# Altium project ACTUALFINALECU.PrjPcb (part 2 of 2)

## Sheet Buck.SchDoc
size A4
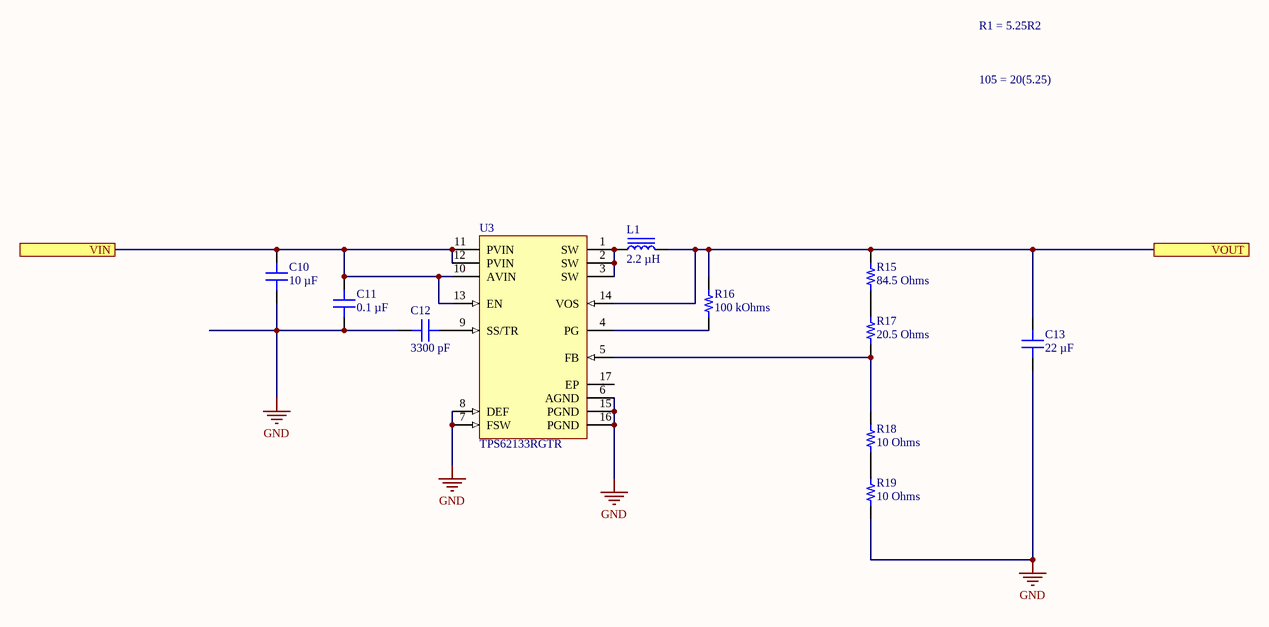
[diagram p7: Buck.SchDoc]

### Parts
C10  10 µF  [CAP 0805_2012]
C11  0.1 µF  [CAP 0805_2012]
C12  3300 pF  [CAP 0805_2012]
C13  22 µF  [CAP 0805_2012]
L1  2.2 µH  [BOURNS SRP5030T]
R15  84.5 Ohms  [RES 0805_2012]
R16  100 kOhms  [RES 0805_2012]
R17  20.5 Ohms  [RES 0805_2012]
R18  10 Ohms  [RES 0805_2012]
R19  10 Ohms  [RES 0805_2012]
U3  TPS62133RGTR  [RGT0016C_V]

### Ports
VIN, VOUT

### Nets
GND: C10.1 C11.1 C12.1 C13.1 R19.1 U3.6(AGND) U3.7(FSW) U3.8(DEF) U3.15(PGND) U3.16(PGND)
VCC5V: C13.2 L1.2 R15.2 R16.2 U3.14(VOS) ; port VOUT
VCC12V: C10.2 C11.2 U3.10(AVIN) U3.11(PVIN) U3.12(PVIN) U3.13(EN) ; port VIN
NetC12_2: C12.2 U3.9(SS/TR)
NetL1_1: L1.1 U3.1(SW) U3.2(SW) U3.3(SW)
NetR15_1: R15.1 R17.2
NetR16_1: R16.1 U3.4(PG)
NetR17_1: R17.1 R18.2 U3.5(FB)
NetR18_1: R18.1 R19.2

Not connected (* = marked no-connect by the designer): U3 17(EP)

### Notes on the sheet
- R1 = 5.25R2
- 105 = 20(5.25)

### Library data of the parts
C10 = CL21Y106KPQVPNE: CAP CER 10UF 10V X7S 0805; manufacturer: Samsung Electro-Mechanics; Tolerance: ±10%; Part Number: CL21Y106KPQVPNE; Value: 10 µF; Applications: Automotive; Capacitance: 10 µF; componentlink1description: Datasheet; componentlink1url: http://www.samsungsem.com/kr/support/product-search/mlcc/CL21Y106KPQVPNE.jsp; componentlink2description: DigiKey Link; componentlink2url: https://www.digikey.com/en/products/detail/samsung-electro-mechanics/CL21Y106KPQVPNE/5961169; Device Package: 0805 (2012 Metric); lastupdated: 2023-10-22 7:13:43 PM; Lifecycle Status: Active; Minimum Order: 1; Mounting Type: Surface Mount, MLCC; Operating Temperature: -55°C ~ 125°C; Package / Case: 0805 (2012 Metric); packaging: TapeAndReel; partid: 2979; Part Status: Active; price: 0.06; Ratings: AEC-Q200; series: CL; Size / Dimension: 0.079" L x 0.049" W (2.00mm x 1.25mm); Supplier 1: DigiKey; Supplier Part Number 1: 1276-6685-1-ND; Temperature Coefficient: X7S; Thickness (Max): 0.055" (1.40mm); Voltage - Rated: 10V
C11 = CC0805MRX7R9BB104: CAP CER 0.1UF 50V X7R 0805; manufacturer: Yageo; Tolerance: ±20%; Part Number: CC0805MRX7R9BB104; Value: 0.1 µF; Applications: General Purpose; Capacitance: 0.1 µF; componentlink1description: Datasheet; componentlink1url: https://www.yageo.com/upload/media/product/productsearch/datasheet/mlcc/UPY-GPHC_X7R_6.3V-to-50V_18.pdf; componentlink2description: DigiKey Link; componentlink2url: https://www.digikey.com/en/products/detail/yageo/CC0805MRX7R9BB104/5884281; Device Package: 0805 (2012 Metric); lastupdated: 2023-10-22 7:13:44 PM; Lifecycle Status: Active; Minimum Order: 1; Mounting Type: Surface Mount, MLCC; Operating Temperature: -55°C ~ 125°C; Package / Case: 0805 (2012 Metric); packaging: TapeAndReel; partid: 2475; Part Status: Active; price: 0.01; series: CC; Size / Dimension: 0.079" L x 0.049" W (2.00mm x 1.25mm); Supplier 1: DigiKey; Supplier Part Number 1: 311-4351-1-ND; Temperature Coefficient: X7R; Thickness (Max): 0.037" (0.95mm); Voltage - Rated: 50V
C12 = C0805X332KARAC3316: CAP CER 0805 3.3NF 250V X7R; manufacturer: KEMET; Tolerance: ±10%; Part Number: C0805X332KARAC3316; Value: 3300 pF; Applications: Automotive, Boardflex Sensitive; Capacitance: 3300 pF; componentlink1description: Datasheet; componentlink1url: https://api.kemet.com/component-edge/download/datasheet/C0805X332KARAC3316.pdf; componentlink2description: DigiKey Link; componentlink2url: https://www.digikey.com/en/products/detail/kemet/C0805X332KARAC3316/10315785; Device Package: 0805 (2012 Metric); Features: Soft Termination; lastupdated: 2023-10-22 7:13:17 PM; Lifecycle Status: Active; Minimum Order: 1; Mounting Type: Surface Mount, MLCC; Operating Temperature: -55°C ~ 125°C; Package / Case: 0805 (2012 Metric); packaging: TapeAndReel; partid: 14175; Part Status: Active; price: 0.13; Ratings: AEC-Q200; series: SMD Auto X7R VW80808; Size / Dimension: 0.079" L x 0.049" W (2.00mm x 1.25mm); Supplier 1: DigiKey; Supplier Part Number 1: 399-C0805X332KARAC3316CT-ND; Temperature Coefficient: X7R; Thickness (Max): 0.039" (0.98mm); Voltage - Rated: 250V
C13 = CL21A226KOQNNNG: CAP CER 22UF 16V X5R 0805; manufacturer: Samsung Electro-Mechanics; Tolerance: ±10%; Part Number: CL21A226KOQNNNG; Value: 22 µF; Applications: General Purpose; Capacitance: 22 µF; componentlink1description: Datasheet; componentlink1url: //media.digikey.com/pdf/Data%20Sheets/Samsung%20PDFs/CL21A226KOQNNNG_Spec.pdf; componentlink2description: DigiKey Link; componentlink2url: https://www.digikey.com/en/products/detail/samsung-electro-mechanics/CL21A226KOQNNNG/3894433; Device Package: 0805 (2012 Metric); lastupdated: 2023-10-22 7:13:43 PM; Lifecycle Status: Active; Minimum Order: 1; Mounting Type: Surface Mount, MLCC; Operating Temperature: -55°C ~ 85°C; Package / Case: 0805 (2012 Metric); packaging: TapeAndReel; partid: 3000; Part Status: Active; price: 0.06; series: CL; Size / Dimension: 0.079" L x 0.049" W (2.00mm x 1.25mm); Supplier 1: DigiKey; Supplier Part Number 1: 1276-7092-1-ND; Temperature Coefficient: X5R; Thickness (Max): 0.055" (1.40mm); Voltage - Rated: 16V
L1 = SRP5030T-2R2M: FIXED IND 2.2UH 5.5A 35 MOHM SMD; Manufacturer: Bourns Inc.; Current - Saturation: 9A; DC Resistance (DCR): 35mOhm Max; Inductance Frequency - Test: 100 kHz; Material - Core: Iron Powder; Shielding: Shielded; Tolerance: ±20%; Type: Drum Core, Wirewound; Part Number: SRP5030T-2R2M; ComponentLink1Description: Datasheet; ComponentLink1URL: https://www.bourns.com/docs/Product-Datasheets/SRP5030T.pdf; ComponentLink2Description: DigiKey Link; ComponentLink2URL: https://www.digikey.com/en/products/detail/bourns-inc/SRP5030T-2R2M/3986082; Current Rating (Amps): 5.5 A; Device Package: Nonstandard; Height - Seated (Max): 0.118" (3.00mm); Inductance: 2.2 µH; LastUpdated: 2023-10-22 8:26:41 PM; Lifecycle Status: Active; Minimum Order: 1; Mounting Type: Surface Mount; Operating Temperature: -40°C ~ 125°C; Package / Case: Nonstandard; Packaging: TapeAndReel; PartId: 7; Part Status: Active; Price: 0.59; Series: SRP5030T; Size / Dimension: 0.224" L x 0.205" W (5.70mm x 5.20mm); Supplier 1: DigiKey; Supplier Part Number 1: SRP5030T-2R2MCT-ND; Value: 2.2 µH
R15 = ERA-6AEB84R5V: RES 84.5 OHM 0.1% 1/8W 0805; Manufacturer: Panasonic Electronic Components; Power (Watts): 0.125W, 1/8W; Temperature Coefficient: ±25ppm/°C; Part Number: ERA-6AEB84R5V; Value: 84.5 Ohms; ComponentLink1Description: Datasheet; ComponentLink1URL: https://industrial.panasonic.com/cdbs/www-data/pdf/RDM0000/AOA0000C307.pdf; ComponentLink2Description: DigiKey Link; ComponentLink2URL: https://www.digikey.com/en/products/detail/panasonic-electronic-components/ERA-6AEB84R5V/2025567; Composition: Thin Film; Device Package: 0805 (2012 Metric); Features: Automotive AEC-Q200; Height - Seated (Max): 0.024" (0.60mm); LastUpdated: 2023-10-22 7:54:59 PM; Lifecycle Status: Active; Minimum Order: 1; Number of Terminations: 2; Operating Temperature: -55°C ~ 155°C; Package / Case: 0805 (2012 Metric); Packaging: TapeAndReel; PartId: 35707; Part Status: Active; Price: 0.03; Ratings: AEC-Q200; Resistance: 84.5 Ohms; Series: ERA-6A; Size / Dimension: 0.079" L x 0.049" W (2.00mm x 1.25mm); Supplier 1: DigiKey; Supplier Part Number 1: P84.5DACT-ND; Supplier Device Package: 0805; Tolerance: ±0.1%
R16 = CPF0805B100KE: RES SMD 100K OHM 0.1% 1/10W 0805; Manufacturer: TE Connectivity Passive Product; Power (Watts): 0.1W, 1/10W; Temperature Coefficient: ±25ppm/°C; Part Number: CPF0805B100KE; Value: 100 kOhms; ComponentLink1Description: Datasheet; ComponentLink1URL: https://www.te.com/commerce/DocumentDelivery/DDEController?Action=srchrtrv&DocNm=1773200&DocType=DS&DocLang=English; ComponentLink2Description: DigiKey Link; ComponentLink2URL: https://www.digikey.com/en/products/detail/te-connectivity-passive-product/CPF0805B100KE/2389788; Composition: Thin Film; Device Package: 0805 (2012 Metric); Height - Seated (Max): 0.026" (0.65mm); LastUpdated: 2023-10-22 7:55:33 PM; Lifecycle Status: Active; Minimum Order: 1; Number of Terminations: 2; Operating Temperature: -55°C ~ 155°C; Package / Case: 0805 (2012 Metric); Packaging: TapeAndReel; PartId: 27729; Part Status: Active; Price: 0.09; Resistance: 100 kOhms; Series: CPF, Neohm; Size / Dimension: 0.079" L x 0.049" W (2.00mm x 1.25mm); Supplier 1: DigiKey; Supplier Part Number 1: A106042CT-ND; Supplier Device Package: 0805; Tolerance: ±0.1%
R17 = ERJ-6ENF20R5V: RES SMD 20.5 OHM 1% 1/8W 0805; Manufacturer: Panasonic Electronic Components; Power (Watts): 0.125W, 1/8W; Temperature Coefficient: ±100ppm/°C; Part Number: ERJ-6ENF20R5V; Value: 20.5 Ohms; ComponentLink1Description: Datasheet; ComponentLink1URL: https://industrial.panasonic.com/cdbs/www-data/pdf/RDA0000/AOA0000C304.pdf; ComponentLink2Description: DigiKey Link; ComponentLink2URL: https://www.digikey.com/en/products/detail/panasonic-electronic-components/ERJ-6ENF20R5V/110953; Composition: Thick Film; Device Package: 0805 (2012 Metric); Features: Automotive AEC-Q200; Height - Seated (Max): 0.028" (0.70mm); LastUpdated: 2023-10-22 7:55:22 PM; Lifecycle Status: Active; Minimum Order: 1; Number of Terminations: 2; Operating Temperature: -55°C ~ 155°C; Package / Case: 0805 (2012 Metric); Packaging: TapeAndReel; PartId: 30259; Part Status: Active; Price: 0.01; Ratings: AEC-Q200; Resistance: 20.5 Ohms; Series: ERJ-6EN; Size / Dimension: 0.079" L x 0.049" W (2.00mm x 1.25mm); Supplier 1: DigiKey; Supplier Part Number 1: P20.5CCT-ND; Supplier Device Package: 0805; Tolerance: ±1%
R18 R19 = RNCS0805BKE10R0: RES 10 OHM 0.1% 1/10W 0805; Manufacturer: Stackpole Electronics Inc; Power (Watts): 0.1W, 1/10W; Temperature Coefficient: ±25ppm/°C; Part Number: RNCS0805BKE10R0; Value: 10 Ohms; ComponentLink1Description: Datasheet; ComponentLink1URL: https://www.seielect.com/catalog/sei-rncs_rnch.pdf; ComponentLink2Description: DigiKey Link; ComponentLink2URL: https://www.digikey.com/en/products/detail/stackpole-electronics-inc/RNCS0805BKE10R0/1800064; Composition: Thin Film; Device Package: 0805 (2012 Metric); Features: Anti-Corrosive, Automotive AEC-Q200, Moisture Resistant; Height - Seated (Max): 0.026" (0.65mm); LastUpdated: 2023-10-22 7:55:33 PM; Lifecycle Status: Active; Minimum Order: 1; Number of Terminations: 2; Operating Temperature: -55°C ~ 155°C; Package / Case: 0805 (2012 Metric); Packaging: TapeAndReel; PartId: 27711; Part Status: Active; Price: 0.07; Ratings: AEC-Q200; Resistance: 10 Ohms; Series: RNCS; Size / Dimension: 0.079" L x 0.049" W (2.00mm x 1.25mm); Supplier 1: DigiKey; Supplier Part Number 1: RNCS0805BKE10R0CT-ND; Supplier Device Package: 0805; Tolerance: ±0.1%
U3 = CMP-0323-00146-3: Buck Step Down Regulator with 3 to 17 V Input and 5 V Output, -40 to 85 degC, 16-Pin QFN (RGT), Green (RoHS & no Sb/Br); Manufacturer: Texas Instruments; Preset Vout(V): 5; Regulated Outputs(#): 1; Synchronous Rectification: TRUE; Duty Cycle(Max)(%): 100; Vin(Min)(V): 3; Vin(Max)(V): 17; Rating: Catalog; SubFamily: Step-Down Regulator; Switch Current Limit(Typ)(A): 4.2; Iq(Typ)(mA): 0.017; ComponentLink1Description: Datasheet; PackageVersion: revH, Oct-2011; ComponentLink2URL: http://www.ti.com/litv/pdf/mpqf119g; Code_JEDEC: MO-220; ComponentLink2Description: Package Specification; Vout(Max)(V): 5; ComponentLink3URL: Samples URL:http://www.ti.com/product/tps62133#samples; PackageReference: RGT0016C; ComponentLink3Description: URL Link1; Mounting Technology: Surface Mount; DatasheetVersion: SLVSAG7; PartNumber: TPS62133RGTR; Iout(Max)(A): 3; Eco-Plan: Green (RoHS & no Sb/Br); PackageDescription: 16-Pin Plastic Quad Flat No-Lead, 3 x 3 mm Body, 0.5 mm Pitch, 1.7 x 1.7 mm Exposed Pad; Topology: Buck; Vout(Min)(V): 5; ComponentLink1URL: http://www.ti.com/general/docs/lit/getliterature.tsp?genericPartNumber=TPS62133&fileType=pdf

## Sheet LDO.SchDoc
size A4
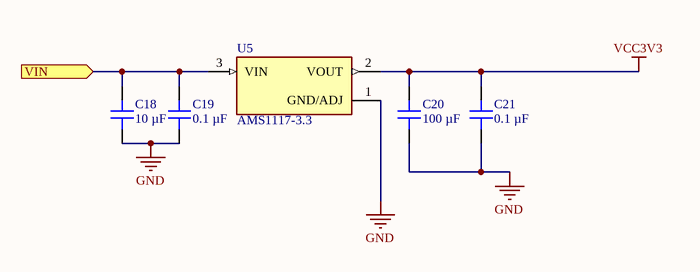
[diagram p8: LDO.SchDoc]

### Parts
C18  10 µF  [CAP 0805_2012]
C19  0.1 µF  [CAP 0805_2012]
C20  100 µF  [CAP 0805_2012]
C21  0.1 µF  [CAP 0805_2012]
U5  AMS1117-3.3  [SOT229P700X180-4N]

### Ports
VIN (in)

### Nets
GND: C18.1 C19.1 C20.1 C21.1 U5.1(GND/ADJ)
VCC3V3: C20.2 C21.2 U5.2(VOUT)
VCC5V: C18.2 C19.2 U5.3(VIN) ; port VIN

### Library data of the parts
C18 = C2012X6S1C106K125AC: CAP CER 10UF 16V X6S 0805; manufacturer: TDK Corporation; Tolerance: ±10%; Part Number: C2012X6S1C106K125AC; Value: 10 µF; Applications: General Purpose; Capacitance: 10 µF; componentlink1description: Datasheet; componentlink1url: https://product.tdk.com/info/en/catalog/datasheets/mlcc_commercial_general_en.pdf?ref_disty=digikey; componentlink2description: DigiKey Link; componentlink2url: https://www.digikey.com/en/products/detail/tdk-corporation/C2012X6S1C106K125AC/2733046; Device Package: 0805 (2012 Metric); Features: Low ESL; lastupdated: 2023-10-02 7:13:05 PM; Lifecycle Status: Active; Minimum Order: 1; Mounting Type: Surface Mount, MLCC; Operating Temperature: -55°C ~ 105°C; Package / Case: 0805 (2012 Metric); packaging: TapeAndReel; partid: 2995; Part Status: Active; price: 0.07; series: C; Size / Dimension: 0.079" L x 0.049" W (2.00mm x 1.25mm); Supplier 1: DigiKey; Supplier Part Number 1: 445-7611-1-ND; Temperature Coefficient: X6S; Thickness (Max): 0.057" (1.45mm); Voltage - Rated: 16V
C19 C21 = CC0805MRX7R9BB104: as C11 on sheet Buck; Part Number: CC0805MRX7R9BB104; Value: 0.1 µF; Applications: General Purpose; Capacitance: 0.1 µF; componentlink1description: Datasheet; componentlink1url: https://www.yageo.com/upload/media/product/productsearch/datasheet/mlcc/UPY-GPHC_X7R_6.3V-to-50V_18.pdf; componentlink2description: DigiKey Link; componentlink2url: https://www.digikey.com/en/products/detail/yageo/CC0805MRX7R9BB104/5884281; Device Package: 0805 (2012 Metric); lastupdated: 2023-10-02 7:13:07 PM; Lifecycle Status: Active; Minimum Order: 1; Mounting Type: Surface Mount, MLCC; Operating Temperature: -55°C ~ 125°C; Package / Case: 0805 (2012 Metric); packaging: TapeAndReel; partid: 2475; Part Status: Active; price: 0.01; series: CC; Size / Dimension: 0.079" L x 0.049" W (2.00mm x 1.25mm); Supplier 1: DigiKey; Supplier Part Number 1: 311-4351-1-ND; Temperature Coefficient: X7R; Thickness (Max): 0.037" (0.95mm); Voltage - Rated: 50V
C20 = PMK212BBJ107MG-T: CAP CER 100UF 2.5V X5R 0805; manufacturer: Taiyo Yuden; Tolerance: ±20%; Part Number: PMK212BBJ107MG-T; Value: 100 µF; Applications: SMPS Filtering; Capacitance: 100 µF; componentlink1description: Datasheet; componentlink1url: https://ds.yuden.co.jp/TYCOMPAS/ut/detail?pn=PMK212BBJ107MG-T  &u=M; componentlink2description: DigiKey Link; componentlink2url: https://www.digikey.com/en/products/detail/taiyo-yuden/PMK212BBJ107MG-T/4950524; Device Package: 0805 (2012 Metric); lastupdated: 2023-10-02 7:12:56 PM; Lifecycle Status: Active; Minimum Order: 1; Mounting Type: Surface Mount, MLCC; Operating Temperature: -55°C ~ 85°C; Package / Case: 0805 (2012 Metric); packaging: TapeAndReel; partid: 7580; Part Status: Active; price: 0.48; series: M; Size / Dimension: 0.079" L x 0.049" W (2.00mm x 1.25mm); Supplier 1: DigiKey; Supplier Part Number 1: 587-3978-1-ND; Temperature Coefficient: X5R; Thickness (Max): 0.053" (1.35mm); Voltage - Rated: 2.5V
U5 = AMS1117-3.3: Sot223/Pkg 1-Amp 3.3-Volt Low Drop Out Voltage Regulatator; MF: Advanced Monolithic Systems; Package: SOT-223 Seeed Technology; Value: *; Check_prices: https://www.snapeda.com/parts/AMS1117-3.3/Advanced+Monolithic+Systems/view-part/?ref=eda; Price: None; Availability: Not in stock; MP: AMS1117-3.3; SnapEDA_Link: https://www.snapeda.com/parts/AMS1117-3.3/Advanced+Monolithic+Systems/view-part/?ref=snap

## Sheet Connectors.SchDoc
size A4
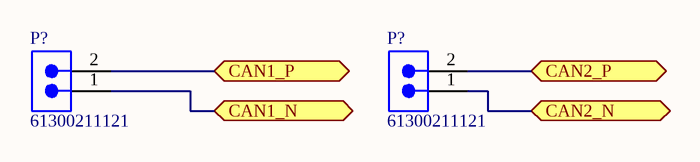
[diagram p9: Connectors.SchDoc]

### Parts
(Parts that share a designator on the sheet are numbered #1, #2 ... from top to bottom, then left to right.)
P?#5  61300211121  [61300211121]
P?#6  61300211121  [61300211121]

### Ports
CAN1_N (bidir), CAN1_P (bidir), CAN2_N (bidir), CAN2_P (bidir)

### Nets
CAN1_N: P?#5.1 ; port CAN1_N
CAN1_P: P?#5.2 ; port CAN1_P
CAN2_N: P?#6.1 ; port CAN2_N
CAN2_P: P?#6.2 ; port CAN2_P

### Library data of the parts
P?#5 P?#6 = CMP-1712-00002-5: NexarPartId: 20081794; Operating Supply Voltage: 250V; Current Rating: 3A; Gender: Male; Number of Contacts: 2; Pitch: 2.54mm; Connector Type: Male Pin; Contact Resistance: 20mΩ; Contact Plating: Gold; Contact Material: Copper; Number of Pins: 2; Min Operating Temperature: -40°C; Packaging: Bulk; Lead Pitch: 2.54mm; Mount: Through Hole; Orientation: Vertical; RoHS: Compliant; REACH SVHC: No SVHC; Height: 8.94mm; Termination: Through Hole; Number of Positions: 2; Contact Mating Length: 5.9944mm; Color: Black; Contact Gender: Male; Number of Rows: 1; Housing Material: PBT; Lead Free: Lead Free; Voltage Rating: 250V; Max Operating Temperature: 125°C

## Sheet 12V_SIGNAL_BULKHEAD.SchDoc
size A4
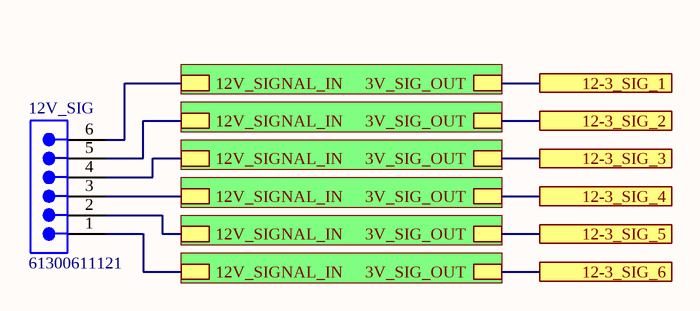
[diagram p10: 12V_SIGNAL_BULKHEAD.SchDoc]

### Parts
12V_SIG  61300611121  [61300611121]

### Sub-sheets
? = 12_TO_3V3_VOLTAGE_DIVIDER.SchDoc: 12V_SIGNAL_IN, 3V_SIG_OUT
? = 12_TO_3V3_VOLTAGE_DIVIDER.SchDoc: 12V_SIGNAL_IN, 3V_SIG_OUT
? = 12_TO_3V3_VOLTAGE_DIVIDER.SchDoc: 12V_SIGNAL_IN, 3V_SIG_OUT
? = 12_TO_3V3_VOLTAGE_DIVIDER.SchDoc: 12V_SIGNAL_IN, 3V_SIG_OUT
? = 12_TO_3V3_VOLTAGE_DIVIDER.SchDoc: 12V_SIGNAL_IN, 3V_SIG_OUT
? = 12_TO_3V3_VOLTAGE_DIVIDER.SchDoc: 12V_SIGNAL_IN, 3V_SIG_OUT

### Ports
12-3_SIG_1, 12-3_SIG_2, 12-3_SIG_3, 12-3_SIG_4, 12-3_SIG_5, 12-3_SIG_6

### Nets
12-3_1: port 12-3_SIG_1, sheet /3V_SIG_OUT
12-3_2: port 12-3_SIG_2, sheet /3V_SIG_OUT
12-3_3: port 12-3_SIG_3, sheet /3V_SIG_OUT
12-3_4: port 12-3_SIG_4, sheet /3V_SIG_OUT
12-3_5: port 12-3_SIG_5, sheet /3V_SIG_OUT
12-3_6: port 12-3_SIG_6, sheet /3V_SIG_OUT
Net12V_SIG_1: 12V_SIG.1 ; sheet /12V_SIGNAL_IN
Net12V_SIG_2: 12V_SIG.2 ; sheet /12V_SIGNAL_IN
Net12V_SIG_3: 12V_SIG.3 ; sheet /12V_SIGNAL_IN
Net12V_SIG_4: 12V_SIG.4 ; sheet /12V_SIGNAL_IN
Net12V_SIG_5: 12V_SIG.5 ; sheet /12V_SIGNAL_IN
Net12V_SIG_6: 12V_SIG.6 ; sheet /12V_SIGNAL_IN

### Library data of the parts
12V_SIG = CMP-1502-01070-2: NexarPartId: 20084590; Operating Supply Voltage: 250V; Current Rating: 3A; Number of Contacts: 6; Gender: Male; Connector Type: Male Pin; Pitch: 2.54mm; Contact Resistance: 20mΩ; Lead Free: Lead Free; REACH SVHC: Unknown; Number of Rows: 1; Color: Black; Min Operating Temperature: -40°C; Contact Material: Copper; Lead Pitch: 2.54mm; Contact Plating: Gold; Number of Pins: 6; Height: 8.89mm; Orientation: Vertical; Termination: Through Hole; Mount: Through Hole; RoHS: Compliant; Contact Gender: Male; Contact Mating Length: 5.9944mm; Voltage Rating: 250V; Number of Positions: 6; Housing Material: PBT; Packaging: Bulk; Max Operating Temperature: 105°C

## Sheet 12_TO_3V3_VOLTAGE_DIVIDER.SchDoc
size A4
Used 6 times, as channels 12 Volt Signal Bulkhead/, 12 Volt Signal Bulkhead/, 12 Volt Signal Bulkhead/, 12 Volt Signal Bulkhead/, 12 Volt Signal Bulkhead/, 12 Volt Signal Bulkhead/. Parts and nets are listed once, with the designators drawn on the sheet.
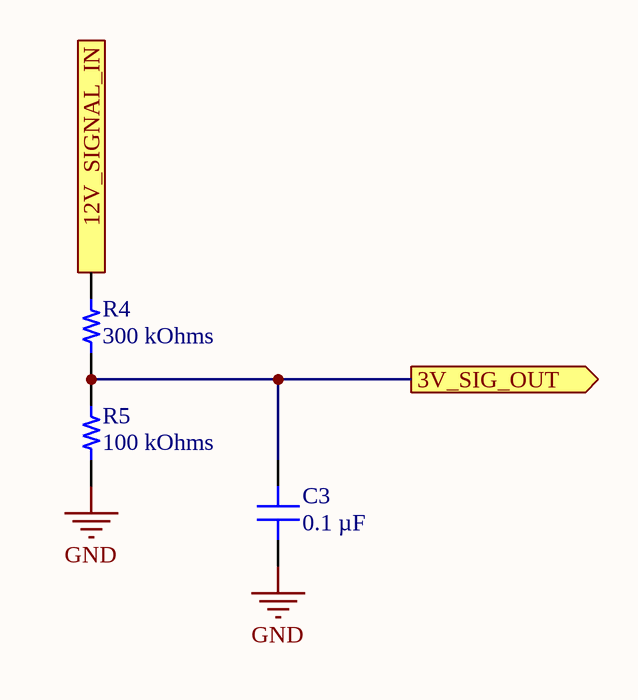
[diagram p11: 12_TO_3V3_VOLTAGE_DIVIDER.SchDoc]

### Parts
C3  0.1 µF  [CAP 0805_2012]
R4  300 kOhms  [RES 0805_2012]
R5  100 kOhms  [RES 0805_2012]

### Ports
3V_SIG_OUT (out), 12V_SIGNAL_IN

### Nets
GND: C3.1 R5.1
3V_SIG_OUT: C3.2 R4.1 R5.2 ; port 3V_SIG_OUT
12V_SIGNAL_IN: R4.2 ; port 12V_SIGNAL_IN

### Channels
12 Volt Signal Bulkhead/: designators end in _6; ports 3V_SIG_OUT=12-3_1 12V_SIGNAL_IN=Net12V_SIG_6
12 Volt Signal Bulkhead/: designators end in _5; ports 3V_SIG_OUT=12-3_2 12V_SIGNAL_IN=Net12V_SIG_5
12 Volt Signal Bulkhead/: designators end in _4; ports 3V_SIG_OUT=12-3_3 12V_SIGNAL_IN=Net12V_SIG_4
12 Volt Signal Bulkhead/: designators end in _3; ports 3V_SIG_OUT=12-3_4 12V_SIGNAL_IN=Net12V_SIG_3
12 Volt Signal Bulkhead/: designators end in _2; ports 3V_SIG_OUT=12-3_5 12V_SIGNAL_IN=Net12V_SIG_2
12 Volt Signal Bulkhead/: designators end in _1; ports 3V_SIG_OUT=12-3_6 12V_SIGNAL_IN=Net12V_SIG_1

### Library data of the parts
C3 = CC0805MRX7R9BB104: as C11 on sheet Buck; Part Number: CC0805MRX7R9BB104; Value: 0.1 µF; Applications: General Purpose; Capacitance: 0.1 µF; componentlink1description: Datasheet; componentlink1url: https://www.yageo.com/upload/media/product/productsearch/datasheet/mlcc/UPY-GPHC_X7R_6.3V-to-50V_18.pdf; componentlink2description: DigiKey Link; componentlink2url: https://www.digikey.com/en/products/detail/yageo/CC0805MRX7R9BB104/5884281; Device Package: 0805 (2012 Metric); lastupdated: 2023-10-02 7:13:07 PM; Lifecycle Status: Active; Minimum Order: 1; Mounting Type: Surface Mount, MLCC; Operating Temperature: -55°C ~ 125°C; Package / Case: 0805 (2012 Metric); packaging: TapeAndReel; partid: 2475; Part Status: Active; price: 0.01; series: CC; Size / Dimension: 0.079" L x 0.049" W (2.00mm x 1.25mm); Supplier 1: DigiKey; Supplier Part Number 1: 311-4351-1-ND; Temperature Coefficient: X7R; Thickness (Max): 0.037" (0.95mm); Voltage - Rated: 50V
R4 = CRCW0805300KJNEA: RES SMD 300K OHM 5% 1/8W 0805; Manufacturer: Vishay Dale; Power (Watts): 0.125W, 1/8W; Temperature Coefficient: ±200ppm/°C; Part Number: CRCW0805300KJNEA; Value: 300 kOhms; ComponentLink1Description: Datasheet; ComponentLink1URL: http://www.vishay.com/docs/20035/dcrcwe3.pdf; ComponentLink2Description: DigiKey Link; ComponentLink2URL: https://www.digikey.com/en/products/detail/vishay-dale/CRCW0805300KJNEA/1175257; Composition: Thick Film; Device Package: 0805 (2012 Metric); Features: Automotive AEC-Q200; Height - Seated (Max): 0.020" (0.50mm); LastUpdated: 2023-10-02 7:52:37 PM; Lifecycle Status: Active; Minimum Order: 1; Number of Terminations: 2; Operating Temperature: -55°C ~ 155°C; Package / Case: 0805 (2012 Metric); Packaging: TapeAndReel; PartId: 29510; Part Status: Active; Price: 0.01; Ratings: AEC-Q200; Resistance: 300 kOhms; Series: CRCW; Size / Dimension: 0.079" L x 0.049" W (2.00mm x 1.25mm); Supplier 1: DigiKey; Supplier Part Number 1: 541-300KACT-ND; Supplier Device Package: 0805; Tolerance: ±5%
R5 = CPF0805B100KE: as R16 on sheet Buck; Part Number: CPF0805B100KE; Value: 100 kOhms; ComponentLink1Description: Datasheet; ComponentLink1URL: https://www.te.com/commerce/DocumentDelivery/DDEController?Action=srchrtrv&DocNm=1773200&DocType=DS&DocLang=English; ComponentLink2Description: DigiKey Link; ComponentLink2URL: https://www.digikey.com/en/products/detail/te-connectivity-passive-product/CPF0805B100KE/2389788; Composition: Thin Film; Device Package: 0805 (2012 Metric); Height - Seated (Max): 0.026" (0.65mm); LastUpdated: 2023-10-02 7:52:44 PM; Lifecycle Status: Active; Minimum Order: 1; Number of Terminations: 2; Operating Temperature: -55°C ~ 155°C; Package / Case: 0805 (2012 Metric); Packaging: TapeAndReel; PartId: 27729; Part Status: Active; Price: 0.09; Resistance: 100 kOhms; Series: CPF, Neohm; Size / Dimension: 0.079" L x 0.049" W (2.00mm x 1.25mm); Supplier 1: DigiKey; Supplier Part Number 1: A106042CT-ND; Supplier Device Package: 0805; Tolerance: ±0.1%

## Sheet 5VBulkhead.SchDoc
size A4
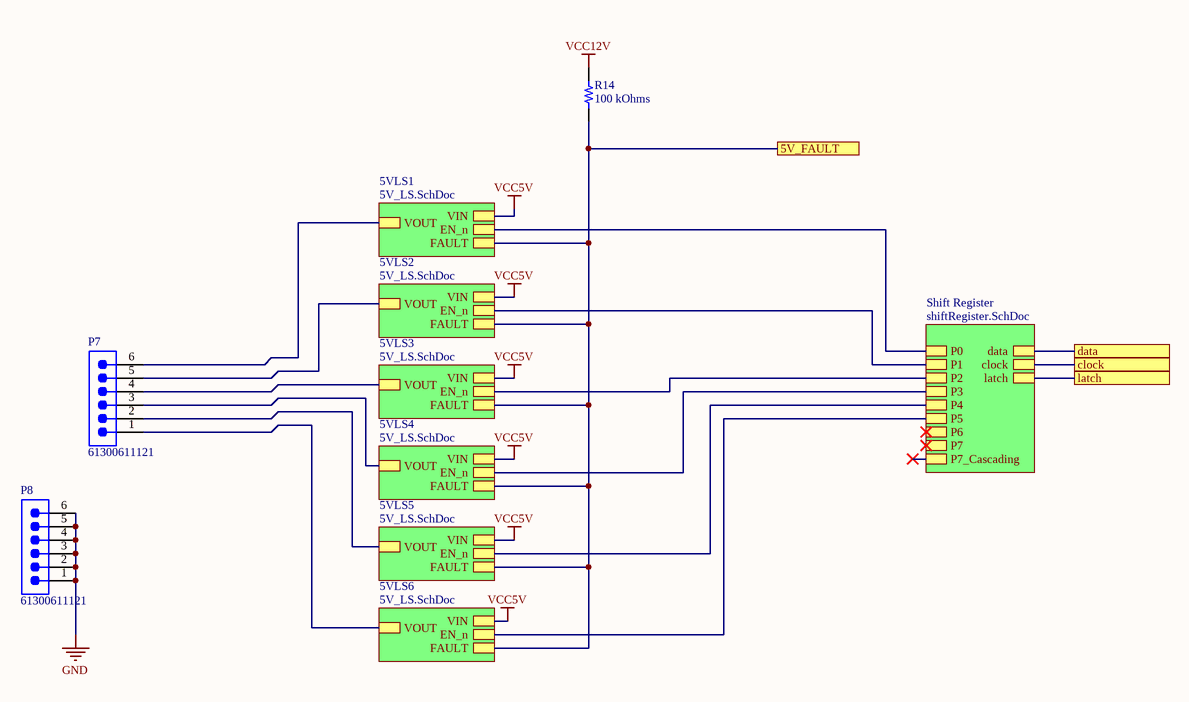
[diagram p12: 5VBulkhead.SchDoc]

### Parts
P7  61300611121  [61300611121]
P8  61300611121  [61300611121]
R14  100 kOhms  [RES 0603_1608]

### Sub-sheets
5VLS1 = 5V_LS.SchDoc: VIN, VOUT, EN_n, FAULT
5VLS2 = 5V_LS.SchDoc: VIN, VOUT, EN_n, FAULT
5VLS3 = 5V_LS.SchDoc: VIN, VOUT, EN_n, FAULT
5VLS4 = 5V_LS.SchDoc: VIN, VOUT, EN_n, FAULT
5VLS5 = 5V_LS.SchDoc: VIN, VOUT, EN_n, FAULT
5VLS6 = 5V_LS.SchDoc: VIN, VOUT, EN_n, FAULT
Shift Register = shiftRegister.SchDoc: P0, P1, P2, P3, P4, P5, P6, P7, P7_Cascading, data, clock, latch

### Ports
5V_FAULT, clock, data, latch

### Nets
GND: P8.1 P8.2 P8.3 P8.4 P8.5 P8.6
VCC5V: sheet 5VLS1/VIN, sheet 5VLS2/VIN, sheet 5VLS3/VIN, sheet 5VLS4/VIN, sheet 5VLS5/VIN, sheet 5VLS6/VIN
VCC12V: R14.2
5V_CLOCK: port clock, sheet Shift Register/clock
5V_DATA: port data, sheet Shift Register/data
5V_FAULT: R14.1 ; port 5V_FAULT, sheet 5VLS1/FAULT, sheet 5VLS2/FAULT, sheet 5VLS3/FAULT, sheet 5VLS4/FAULT, sheet 5VLS5/FAULT, sheet 5VLS6/FAULT
5V_LATCH: port latch, sheet Shift Register/latch
NetC8_5VLS1_2: P7.6 ; sheet 5VLS1/VOUT
NetC8_5VLS2_2: P7.5 ; sheet 5VLS2/VOUT
NetC8_5VLS3_2: P7.4 ; sheet 5VLS3/VOUT
NetC8_5VLS4_2: P7.3 ; sheet 5VLS4/VOUT
NetC8_5VLS5_2: P7.2 ; sheet 5VLS5/VOUT
NetC8_5VLS6_2: P7.1 ; sheet 5VLS6/VOUT
NetR12_5VLS1_1: sheet Shift Register/P0, sheet 5VLS1/EN_n
NetR12_5VLS2_1: sheet Shift Register/P1, sheet 5VLS2/EN_n
NetR12_5VLS3_1: sheet Shift Register/P2, sheet 5VLS3/EN_n
NetR12_5VLS4_1: sheet Shift Register/P3, sheet 5VLS4/EN_n
NetR12_5VLS5_1: sheet Shift Register/P4, sheet 5VLS5/EN_n
NetR12_5VLS6_1: sheet Shift Register/P5, sheet 5VLS6/EN_n

### Library data of the parts
P7 P8 = CMP-1502-01070-2: as 12V_SIG on sheet 12V_SIGNAL_BULKHEAD; Lead Free: Lead Free; REACH SVHC: Unknown; Number of Rows: 1; Color: Black; Min Operating Temperature: -40°C; Contact Material: Copper; Lead Pitch: 2.54mm; Contact Plating: Gold; Number of Pins: 6; Height: 8.89mm; Orientation: Vertical; Termination: Through Hole; Mount: Through Hole; RoHS: Compliant; Contact Gender: Male; Contact Mating Length: 5.9944mm; Voltage Rating: 250V; Number of Positions: 6; Housing Material: PBT; Packaging: Bulk; Max Operating Temperature: 105°C
R14 = RNCS0603BKE100K: RES 100K OHM 0.1% 1/16W 0603; Manufacturer: Stackpole Electronics Inc; Power (Watts): 0.063W, 1/16W; Temperature Coefficient: ±25ppm/°C; Part Number: RNCS0603BKE100K; Value: 100 kOhms; ComponentLink1Description: Datasheet; ComponentLink1URL: https://www.seielect.com/catalog/sei-rncs_rnch.pdf; ComponentLink2Description: DigiKey Link; ComponentLink2URL: https://www.digikey.com/en/products/detail/stackpole-electronics-inc/RNCS0603BKE100K/1708835; Composition: Thin Film; Device Package: 0603 (1608 Metric); Features: Anti-Corrosive, Automotive AEC-Q200, Moisture Resistant; Height - Seated (Max): 0.022" (0.55mm); LastUpdated: 2023-06-08 7:45:17 PM; Lifecycle Status: Active; Minimum Order: 1; Number of Terminations: 2; Operating Temperature: -55°C ~ 155°C; Package / Case: 0603 (1608 Metric); Packaging: TapeAndReel; PartId: 4849; Part Status: Active; Price: 0.07; Ratings: AEC-Q200; Resistance: 100 kOhms; Series: RNCS; Size / Dimension: 0.061" L x 0.031" W (1.55mm x 0.80mm); Supplier 1: DigiKey; Supplier Part Number 1: RNCS0603BKE100KCT-ND; Supplier Device Package: 0603; Tolerance: ±0.1%

## Sheet 5V_LS.SchDoc
size A4
Used 6 times, as channels 5V Power And Ground/5VLS1, 5V Power And Ground/5VLS2, 5V Power And Ground/5VLS3, 5V Power And Ground/5VLS4, 5V Power And Ground/5VLS5, 5V Power And Ground/5VLS6. Parts and nets are listed once, with the designators drawn on the sheet.
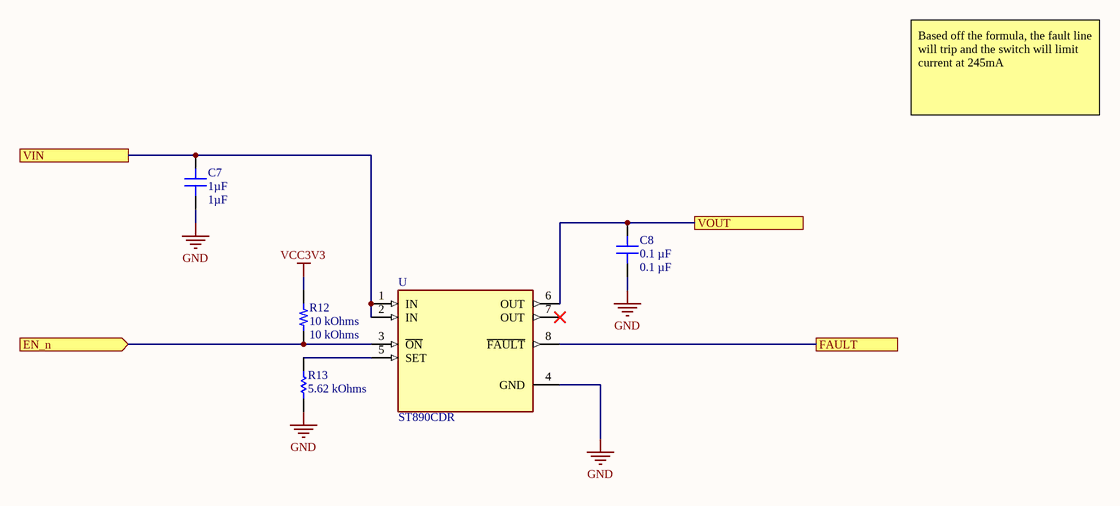
[diagram p13: 5V_LS.SchDoc]

### Parts
C7  1µF  [CAP 0805_2012]
C8  0.1 µF  [CAP 0805_2012]
R12  10 kOhms  [RES 0805_2012]
R13  5.62 kOhms  [RESC2013X60X40ML20T25]
U  ST890CDR  [SOIC127P600X175-8N]

### Ports
EN_n (in), FAULT, VIN, VOUT

### Nets
GND: C7.1 C8.1 R13.1 U.4(GND)
VCC3V3: R12.2
EN_n: R12.1 U.3(~{ON}) ; port EN_n
FAULT: U.8(~{FAULT}) ; port FAULT
VIN: C7.2 U.1(IN) U.2(IN) ; port VIN
VOUT: C8.2 U.6(OUT) ; port VOUT
NetR13_2: R13.2 U.5(SET)

Not connected (* = marked no-connect by the designer): U 7(OUT)*

### Channels
5V Power And Ground/5VLS1: designators end in _5VLS1; ports EN_n=NetR12_5VLS1_1 FAULT=5V_FAULT VIN=VCC5V VOUT=NetC8_5VLS1_2
5V Power And Ground/5VLS2: designators end in _5VLS2; ports EN_n=NetR12_5VLS2_1 FAULT=5V_FAULT VIN=VCC5V VOUT=NetC8_5VLS2_2
5V Power And Ground/5VLS3: designators end in _5VLS3; ports EN_n=NetR12_5VLS3_1 FAULT=5V_FAULT VIN=VCC5V VOUT=NetC8_5VLS3_2
5V Power And Ground/5VLS4: designators end in _5VLS4; ports EN_n=NetR12_5VLS4_1 FAULT=5V_FAULT VIN=VCC5V VOUT=NetC8_5VLS4_2
5V Power And Ground/5VLS5: designators end in _5VLS5; ports EN_n=NetR12_5VLS5_1 FAULT=5V_FAULT VIN=VCC5V VOUT=NetC8_5VLS5_2
5V Power And Ground/5VLS6: designators end in _5VLS6; ports EN_n=NetR12_5VLS6_1 FAULT=5V_FAULT VIN=VCC5V VOUT=NetC8_5VLS6_2

### Notes on the sheet
- Based off the formula, the fault line will trip and the switch will limit current at 245mA

### Library data of the parts
C7 = MM05ZC105KCZ2A: CAP CER 1UF 10V X7R 0805; Part Number: MM05ZC105KCZ2A; Value: 1µF
C8 = CC0805MRX7R9BB104: CAP CER 0.1UF 50V X7R 0805; Part Number: CC0805MRX7R9BB104; Value: 0.1 µF
R12 = RNCS0805BKE10K0: RES 10K OHM 0.1% 1/10W 0805; Part Number: RNCS0805BKE10K0; Value: 10 kOhms
R13 = CMP-2001-00852-1: Part Number: ERA6AEB5621V; Manufacturer: Panasonic
U = ST890CDR: Power Switch/Driver 1:1 P-Channel 1.2A 8-SO; MF: STMicroelectronics; SnapEDA_Link: https://www.snapeda.com/parts/ST890CDR/STMicroelectronics/view-part/496092/?ref=snap; Availability: Unavailable; Price: None; MP: ST890CDR; Package: SOIC-8 STMicroelectronics; Value: *

## Sheet 5V_SIGNAL_BULKHEAD.SchDoc
size A4
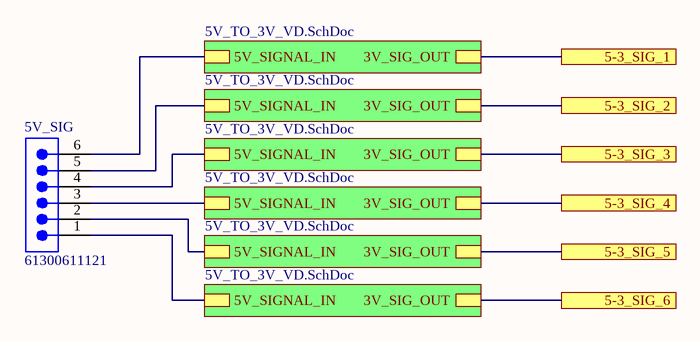
[diagram p14: 5V_SIGNAL_BULKHEAD.SchDoc]

### Parts
5V_SIG  61300611121  [61300611121]

### Sub-sheets
Designator = 5V_TO_3V_VD.SchDoc (file not in this document): 5V_SIGNAL_IN, 3V_SIG_OUT
Designator = 5V_TO_3V_VD.SchDoc (file not in this document): 5V_SIGNAL_IN, 3V_SIG_OUT
Designator = 5V_TO_3V_VD.SchDoc (file not in this document): 5V_SIGNAL_IN, 3V_SIG_OUT
Designator = 5V_TO_3V_VD.SchDoc (file not in this document): 5V_SIGNAL_IN, 3V_SIG_OUT
Designator = 5V_TO_3V_VD.SchDoc (file not in this document): 5V_SIGNAL_IN, 3V_SIG_OUT
Designator = 5V_TO_3V_VD.SchDoc (file not in this document): 5V_SIGNAL_IN, 3V_SIG_OUT

### Ports
5-3_SIG_1, 5-3_SIG_2, 5-3_SIG_3, 5-3_SIG_4, 5-3_SIG_5, 5-3_SIG_6

### Nets
5-3_1: port 5-3_SIG_1, sheet Designator/3V_SIG_OUT
5-3_2: port 5-3_SIG_2, sheet Designator/3V_SIG_OUT
5-3_3: port 5-3_SIG_3, sheet Designator/3V_SIG_OUT
5-3_4: port 5-3_SIG_4, sheet Designator/3V_SIG_OUT
5-3_5: port 5-3_SIG_5, sheet Designator/3V_SIG_OUT
5-3_6: port 5-3_SIG_6, sheet Designator/3V_SIG_OUT
Net5V_SIG_1: 5V_SIG.1 ; sheet Designator/5V_SIGNAL_IN
Net5V_SIG_2: 5V_SIG.2 ; sheet Designator/5V_SIGNAL_IN
Net5V_SIG_3: 5V_SIG.3 ; sheet Designator/5V_SIGNAL_IN
Net5V_SIG_4: 5V_SIG.4 ; sheet Designator/5V_SIGNAL_IN
Net5V_SIG_5: 5V_SIG.5 ; sheet Designator/5V_SIGNAL_IN
Net5V_SIG_6: 5V_SIG.6 ; sheet Designator/5V_SIGNAL_IN

### Library data of the parts
5V_SIG = CMP-1502-01070-2: as 12V_SIG on sheet 12V_SIGNAL_BULKHEAD; Lead Free: Lead Free; REACH SVHC: Unknown; Number of Rows: 1; Color: Black; Min Operating Temperature: -40°C; Contact Material: Copper; Lead Pitch: 2.54mm; Contact Plating: Gold; Number of Pins: 6; Height: 8.89mm; Orientation: Vertical; Termination: Through Hole; Mount: Through Hole; RoHS: Compliant; Contact Gender: Male; Contact Mating Length: 5.9944mm; Voltage Rating: 250V; Number of Positions: 6; Housing Material: PBT; Packaging: Bulk; Max Operating Temperature: 105°C

## Sheet Single_12V.SchDoc
size A4
Used 3 times, as channels Motor Controller 1, Motor Controller 2, Steering. Parts and nets are listed once, with the designators drawn on the sheet.
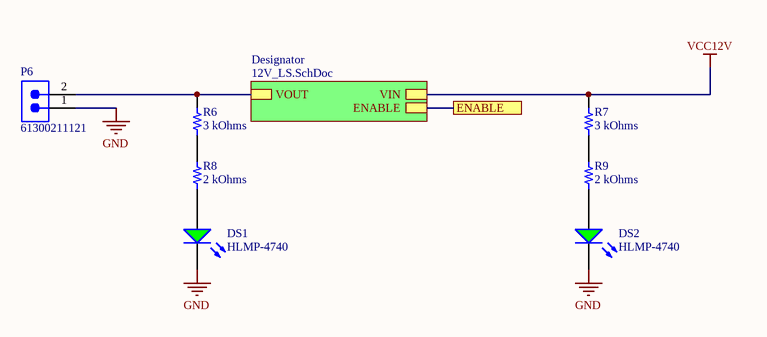
[diagram p15: Single_12V.SchDoc]

### Parts
DS1  HLMP-4740  [AVAG-HLMP-4740]
DS2  HLMP-4740  [AVAG-HLMP-4740]
P6  61300211121  [61300211121]
R6  3 kOhms  [RES 0805_2012]
R7  3 kOhms  [RES 0805_2012]
R8  2 kOhms  [RES 0805_2012]
R9  2 kOhms  [RES 0805_2012]

### Sub-sheets
Designator = 12V_LS.SchDoc: VIN, VOUT, ENABLE

### Ports
ENABLE

### Nets
GND: DS1.2(K) DS2.2(K) P6.1
VCC12V: R7.2 ; sheet Designator/VIN
ENABLE: port ENABLE, sheet Designator/ENABLE
NetDS1_1: DS1.1(A) R8.1
NetDS2_1: DS2.1(A) R9.1
NetP6_2: P6.2 R6.2 ; sheet Designator/VOUT
NetR6_1: R6.1 R8.2
NetR7_1: R7.1 R9.2

### Channels
Motor Controller 1: designators DS1=DS1 DS2=DS2 P6=P6_Motor_Controller_1 R6=R6 R7=R7 R8=R8 R9=R9; ports ENABLE=MC1_ENABLE
Motor Controller 2: designators end in _Motor_Controller_2; ports ENABLE=MC2_ENABLE
Steering: designators end in _Steering; ports ENABLE=STEERING_ENABLE

### Library data of the parts
DS1 DS2 = CMP-2000-06413-1: T-1 3/4 (5 mm) Low Current LED Lamp, Green, 1.9 V, -20 to 100 degC, 2-Pin THD, RoHS, Bulk; Manufacturer: AvagoTechnologies; Type: Uni-Color; Peak Wavelength: 565nm; Rad Hard: No; Viewing Angle: 50°; Dominant Wavelength/Color Temperature: 569nm; Number of LEDs: 1; Lens Appearance: ColoredDiffused; Lens Shape Type: Circular; Mounting Orientation: TopMount; Intensity: 2.3mcd; Datasheet Version: 07/2014; Category: LEDs; Datasheet URL: http://docs.avagotech.com/docs/AV02-1557EN; Packaging: Bulk; Pin Count: 2; Mounting Technology: ThroughHole; Package Reference: HLMP-4740; Mounting: ThroughHole; Manufacturer URL: http://www.avagotech.com/; Color: Green; Package: 2T-13/4; Package Description: 2-Pin Through Hole Device, Dia 5.845 mm, Pitch 2.54 mm
P6 = CMP-1712-00002-5: as P?#5 on sheet Connectors; Contact Plating: Gold; Contact Material: Copper; Number of Pins: 2; Min Operating Temperature: -40°C; Packaging: Bulk; Lead Pitch: 2.54mm; Mount: Through Hole; Orientation: Vertical; RoHS: Compliant; REACH SVHC: No SVHC; Height: 8.94mm; Termination: Through Hole; Number of Positions: 2; Contact Mating Length: 5.9944mm; Color: Black; Contact Gender: Male; Number of Rows: 1; Housing Material: PBT; Lead Free: Lead Free; Voltage Rating: 250V; Max Operating Temperature: 125°C
R6 R7 = RT0805DRD073KL: RES SMD 3K OHM 0.5% 1/8W 0805; Manufacturer: Yageo; Power (Watts): 0.125W, 1/8W; Temperature Coefficient: ±25ppm/°C; Part Number: RT0805DRD073KL; Value: 3 kOhms; ComponentLink1Description: Datasheet; ComponentLink1URL: https://www.yageo.com/upload/media/product/productsearch/datasheet/rchip/PYu-RT_1-to-0.01_RoHS_L_11.pdf; ComponentLink2Description: DigiKey Link; ComponentLink2URL: https://www.digikey.com/en/products/detail/yageo/RT0805DRD073KL/1078142; Composition: Thin Film; Device Package: 0805 (2012 Metric); Height - Seated (Max): 0.024" (0.60mm); LastUpdated: 2023-10-02 7:52:44 PM; Lifecycle Status: Active; Minimum Order: 1; Number of Terminations: 2; Operating Temperature: -55°C ~ 155°C; Package / Case: 0805 (2012 Metric); Packaging: TapeAndReel; PartId: 27799; Part Status: Active; Price: 0.02; Resistance: 3 kOhms; Series: RT; Size / Dimension: 0.079" L x 0.049" W (2.00mm x 1.25mm); Supplier 1: DigiKey; Supplier Part Number 1: 311-2744-1-ND; Supplier Device Package: 0805; Tolerance: ±0.5%
R8 R9 = RCS08052K00FKEA: RES SMD 2K OHM 1% 1/2W 0805; Manufacturer: Vishay Dale; Power (Watts): 0.5W, 1/2W; Temperature Coefficient: ±100ppm/°C; Part Number: RCS08052K00FKEA; Value: 2 kOhms; ComponentLink1Description: Datasheet; ComponentLink1URL: http://www.vishay.com/docs/20065/rcse3.pdf; ComponentLink2Description: DigiKey Link; ComponentLink2URL: https://www.digikey.com/en/products/detail/vishay-dale/RCS08052K00FKEA/5866986; Composition: Thick Film; Device Package: 0805 (2012 Metric); Features: Automotive AEC-Q200, Pulse Withstanding; Height - Seated (Max): 0.020" (0.50mm); LastUpdated: 2023-10-02 7:52:44 PM; Lifecycle Status: Active; Minimum Order: 1; Number of Terminations: 2; Operating Temperature: -55°C ~ 155°C; Package / Case: 0805 (2012 Metric); Packaging: TapeAndReel; PartId: 27786; Part Status: Active; Price: 0.02; Ratings: AEC-Q200; Resistance: 2 kOhms; Series: RCS e3; Size / Dimension: 0.079" L x 0.049" W (2.00mm x 1.25mm); Supplier 1: DigiKey; Supplier Part Number 1: 541-2840-1-ND; Supplier Device Package: 0805; Tolerance: ±1%

## Nets that join several sheets
GND: TOP (28 pins), STM32 (25 pins), Microcontroller/CAN1 (5 pins), Microcontroller/CAN2 (5 pins), 12V_POWER_BULKHEAD (6 pins), 12V Power And Ground/Shift Register (C9_12V_Power_And_Ground_Shift_Register.2 U2_12V_Power_And_Ground_Shift_Register.8 U2_12V_Power_And_Ground_Shift_Register.13), 12V Power And Ground/Designator (5 pins), 12V Power And Ground/Designator (5 pins), 12V Power And Ground/Designator (5 pins), 12V Power And Ground/Designator (5 pins), 12V Power And Ground/Designator (5 pins), 12V Power And Ground/Designator (5 pins), boardPower (8 pins), Buck (10 pins), LDO (5 pins), 12 Volt Signal Bulkhead/ (C3_6.1 R5_6.1), 12 Volt Signal Bulkhead/ (C3_5.1 R5_5.1), 12 Volt Signal Bulkhead/ (C3_4.1 R5_4.1), 12 Volt Signal Bulkhead/ (C3_3.1 R5_3.1), 12 Volt Signal Bulkhead/ (C3_2.1 R5_2.1), 12 Volt Signal Bulkhead/ (C3_1.1 R5_1.1), 5VBulkhead (6 pins), 5V Power And Ground/Shift Register (C9.2 U2.8 U2.13), 5V Power And Ground/5VLS1 (C7_5VLS1.1 C8_5VLS1.1 R13_5VLS1.1 U_5VLS1.4), 5V Power And Ground/5VLS2 (C7_5VLS2.1 C8_5VLS2.1 R13_5VLS2.1 U_5VLS2.4), 5V Power And Ground/5VLS3 (C7_5VLS3.1 C8_5VLS3.1 R13_5VLS3.1 U_5VLS3.4), 5V Power And Ground/5VLS4 (C7_5VLS4.1 C8_5VLS4.1 R13_5VLS4.1 U_5VLS4.4), 5V Power And Ground/5VLS5 (C7_5VLS5.1 C8_5VLS5.1 R13_5VLS5.1 U_5VLS5.4), 5V Power And Ground/5VLS6 (C7_5VLS6.1 C8_5VLS6.1 R13_5VLS6.1 U_5VLS6.4), Motor Controller 1 (DS1.2 DS2.2 P6_Motor_Controller_1.1), Motor Controller 1/Designator (5 pins), Motor Controller 2 (DS1_Motor_Controller_2.2 DS2_Motor_Controller_2.2 P6_Motor_Controller_2.1), Motor Controller 2/Designator (5 pins), Steering (DS1_Steering.2 DS2_Steering.2 P6_Steering.1), Steering/Designator (5 pins)
VCC3V3: STM32 (18 pins), Microcontroller/CAN1 (C26_CAN1.2 U4_CAN1.5), Microcontroller/CAN2 (C26_CAN2.2 U4_CAN2.5), 12V Power And Ground/Designator (C6_12V_Power_And_Ground_Designator#1.2 R10_12V_Power_And_Ground_Designator#1.2 U1_12V_Power_And_Ground_Designator#1.3), 12V Power And Ground/Designator (C6_12V_Power_And_Ground_Designator#2.2 R10_12V_Power_And_Ground_Designator#2.2 U1_12V_Power_And_Ground_Designator#2.3), 12V Power And Ground/Designator (C6_12V_Power_And_Ground_Designator#3.2 R10_12V_Power_And_Ground_Designator#3.2 U1_12V_Power_And_Ground_Designator#3.3), 12V Power And Ground/Designator (C6_12V_Power_And_Ground_Designator#4.2 R10_12V_Power_And_Ground_Designator#4.2 U1_12V_Power_And_Ground_Designator#4.3), 12V Power And Ground/Designator (C6_12V_Power_And_Ground_Designator#5.2 R10_12V_Power_And_Ground_Designator#5.2 U1_12V_Power_And_Ground_Designator#5.3), 12V Power And Ground/Designator (C6_12V_Power_And_Ground_Designator#6.2 R10_12V_Power_And_Ground_Designator#6.2 U1_12V_Power_And_Ground_Designator#6.3), LDO (C20.2 C21.2 U5.2), 5V Power And Ground/5VLS1 (R12_5VLS1.2), 5V Power And Ground/5VLS2 (R12_5VLS2.2), 5V Power And Ground/5VLS3 (R12_5VLS3.2), 5V Power And Ground/5VLS4 (R12_5VLS4.2), 5V Power And Ground/5VLS5 (R12_5VLS5.2), 5V Power And Ground/5VLS6 (R12_5VLS6.2), Motor Controller 1/Designator (C6.2 R10.2 U1.3), Motor Controller 2/Designator (C6_Motor_Controller_2_Designator.2 R10_Motor_Controller_2_Designator.2 U1_Motor_Controller_2_Designator.3), Steering/Designator (C6_Steering_Designator.2 R10_Steering_Designator.2 U1_Steering_Designator.3)
VCC5V: Microcontroller/CAN1 (C38_CAN1.2 U4_CAN1.3), Microcontroller/CAN2 (C38_CAN2.2 U4_CAN2.3), 12V Power And Ground/Shift Register (C9_12V_Power_And_Ground_Shift_Register.1 U2_12V_Power_And_Ground_Shift_Register.10 U2_12V_Power_And_Ground_Shift_Register.16), boardPower (R34.2), Buck (5 pins), LDO (C18.2 C19.2 U5.3), 5V Power And Ground/Shift Register (C9.1 U2.10 U2.16), 5V Power And Ground/5VLS1 (C7_5VLS1.2 U_5VLS1.1 U_5VLS1.2), 5V Power And Ground/5VLS2 (C7_5VLS2.2 U_5VLS2.1 U_5VLS2.2), 5V Power And Ground/5VLS3 (C7_5VLS3.2 U_5VLS3.1 U_5VLS3.2), 5V Power And Ground/5VLS4 (C7_5VLS4.2 U_5VLS4.1 U_5VLS4.2), 5V Power And Ground/5VLS5 (C7_5VLS5.2 U_5VLS5.1 U_5VLS5.2), 5V Power And Ground/5VLS6 (C7_5VLS6.2 U_5VLS6.1 U_5VLS6.2)
VCC12V: 12V Power And Ground/Designator (C1_12V_Power_And_Ground_Designator#1.1 C4_12V_Power_And_Ground_Designator#1.1 U1_12V_Power_And_Ground_Designator#1.1 U1_12V_Power_And_Ground_Designator#1.9), 12V Power And Ground/Designator (C1_12V_Power_And_Ground_Designator#2.1 C4_12V_Power_And_Ground_Designator#2.1 U1_12V_Power_And_Ground_Designator#2.1 U1_12V_Power_And_Ground_Designator#2.9), 12V Power And Ground/Designator (C1_12V_Power_And_Ground_Designator#3.1 C4_12V_Power_And_Ground_Designator#3.1 U1_12V_Power_And_Ground_Designator#3.1 U1_12V_Power_And_Ground_Designator#3.9), 12V Power And Ground/Designator (C1_12V_Power_And_Ground_Designator#4.1 C4_12V_Power_And_Ground_Designator#4.1 U1_12V_Power_And_Ground_Designator#4.1 U1_12V_Power_And_Ground_Designator#4.9), 12V Power And Ground/Designator (C1_12V_Power_And_Ground_Designator#5.1 C4_12V_Power_And_Ground_Designator#5.1 U1_12V_Power_And_Ground_Designator#5.1 U1_12V_Power_And_Ground_Designator#5.9), 12V Power And Ground/Designator (C1_12V_Power_And_Ground_Designator#6.1 C4_12V_Power_And_Ground_Designator#6.1 U1_12V_Power_And_Ground_Designator#6.1 U1_12V_Power_And_Ground_Designator#6.9), boardPower (7 pins), Buck (6 pins), 5VBulkhead (R14.2), Motor Controller 1 (R7.2), Motor Controller 1/Designator (C1.1 C4_Motor_Controller_1_Designator.1 U1.1 U1.9), Motor Controller 2 (R7_Motor_Controller_2.2), Motor Controller 2/Designator (C1_Motor_Controller_2_Designator.1 C4_Motor_Controller_2_Designator.1 U1_Motor_Controller_2_Designator.1 U1_Motor_Controller_2_Designator.9), Steering (R7_Steering.2), Steering/Designator (C1_Steering_Designator.1 C4_Steering_Designator.1 U1_Steering_Designator.1 U1_Steering_Designator.9)
5V_CLOCK: STM32 (U6.1), 5V Power And Ground/Shift Register (U2.11)
5V_DATA: STM32 (U6.5), 5V Power And Ground/Shift Register (U2.14)
5V_FAULT: STM32 (U6.80), 5VBulkhead (R14.1), 5V Power And Ground/5VLS1 (U_5VLS1.8), 5V Power And Ground/5VLS2 (U_5VLS2.8), 5V Power And Ground/5VLS3 (U_5VLS3.8), 5V Power And Ground/5VLS4 (U_5VLS4.8), 5V Power And Ground/5VLS5 (U_5VLS5.8), 5V Power And Ground/5VLS6 (U_5VLS6.8)
5V_LATCH: STM32 (U6.3), 5V Power And Ground/Shift Register (U2.12)
12-3_1: STM32 (U6.15), 12 Volt Signal Bulkhead/ (C3_6.2 R4_6.1 R5_6.2)
12-3_2: STM32 (U6.16), 12 Volt Signal Bulkhead/ (C3_5.2 R4_5.1 R5_5.2)
12-3_3: STM32 (U6.36), 12 Volt Signal Bulkhead/ (C3_4.2 R4_4.1 R5_4.2)
12-3_4: STM32 (U6.18), 12 Volt Signal Bulkhead/ (C3_3.2 R4_3.1 R5_3.2)
12-3_5: STM32 (U6.26), 12 Volt Signal Bulkhead/ (C3_2.2 R4_2.1 R5_2.2)
12-3_6: STM32 (U6.25), 12 Volt Signal Bulkhead/ (C3_1.2 R4_1.1 R5_1.2)
12V_CLOCK: STM32 (U6.78), 12V Power And Ground/Shift Register (U2_12V_Power_And_Ground_Shift_Register.11)
12V_DATA: STM32 (U6.35), 12V Power And Ground/Shift Register (U2_12V_Power_And_Ground_Shift_Register.14)
12V_LATCH: STM32 (U6.77), 12V Power And Ground/Shift Register (U2_12V_Power_And_Ground_Shift_Register.12)
CAN1_N: Microcontroller/CAN1 (R20_CAN1.1 U4_CAN1.6), Connectors (P?#5.1)
CAN1_P: Microcontroller/CAN1 (SW1_CAN1.1 U4_CAN1.7), Connectors (P?#5.2)
CAN1_RX: STM32 (U6.70), Microcontroller/CAN1 (U4_CAN1.4)
CAN1_STBY: STM32 (U6.69), Microcontroller/CAN1 (U4_CAN1.8)
CAN1_TX: STM32 (U6.71), Microcontroller/CAN1 (U4_CAN1.1)
CAN2_N: Microcontroller/CAN2 (R20_CAN2.1 U4_CAN2.6), Connectors (P?#6.1)
CAN2_P: Microcontroller/CAN2 (SW1_CAN2.1 U4_CAN2.7), Connectors (P?#6.2)
CAN2_RX: STM32 (U6.51), Microcontroller/CAN2 (U4_CAN2.4)
CAN2_STBY: STM32 (U6.53), Microcontroller/CAN2 (U4_CAN2.8)
CAN2_TX: STM32 (U6.52), Microcontroller/CAN2 (U4_CAN2.1)
MC1_ENABLE: STM32 (U6.44), Motor Controller 1/Designator (U1.2)
MC2_ENABLE: STM32 (U6.45), Motor Controller 2/Designator (U1_Motor_Controller_2_Designator.2)
Net12V_SIG_1: 12V_SIGNAL_BULKHEAD (12V_SIG.1), 12 Volt Signal Bulkhead/ (R4_1.2)
Net12V_SIG_2: 12V_SIGNAL_BULKHEAD (12V_SIG.2), 12 Volt Signal Bulkhead/ (R4_2.2)
Net12V_SIG_3: 12V_SIGNAL_BULKHEAD (12V_SIG.3), 12 Volt Signal Bulkhead/ (R4_3.2)
Net12V_SIG_4: 12V_SIGNAL_BULKHEAD (12V_SIG.4), 12 Volt Signal Bulkhead/ (R4_4.2)
Net12V_SIG_5: 12V_SIGNAL_BULKHEAD (12V_SIG.5), 12 Volt Signal Bulkhead/ (R4_5.2)
Net12V_SIG_6: 12V_SIGNAL_BULKHEAD (12V_SIG.6), 12 Volt Signal Bulkhead/ (R4_6.2)
NetC5_12V_Power_And_Ground_Designator#1_2: 12V_POWER_BULKHEAD (P?#1.6), 12V Power And Ground/Designator (C5_12V_Power_And_Ground_Designator#1.2 R11_12V_Power_And_Ground_Designator#1.1 U1_12V_Power_And_Ground_Designator#1.8)
NetC5_12V_Power_And_Ground_Designator#2_2: 12V_POWER_BULKHEAD (P?#1.5), 12V Power And Ground/Designator (C5_12V_Power_And_Ground_Designator#2.2 R11_12V_Power_And_Ground_Designator#2.1 U1_12V_Power_And_Ground_Designator#2.8)
NetC5_12V_Power_And_Ground_Designator#3_2: 12V_POWER_BULKHEAD (P?#1.4), 12V Power And Ground/Designator (C5_12V_Power_And_Ground_Designator#3.2 R11_12V_Power_And_Ground_Designator#3.1 U1_12V_Power_And_Ground_Designator#3.8)
NetC5_12V_Power_And_Ground_Designator#4_2: 12V_POWER_BULKHEAD (P?#1.3), 12V Power And Ground/Designator (C5_12V_Power_And_Ground_Designator#4.2 R11_12V_Power_And_Ground_Designator#4.1 U1_12V_Power_And_Ground_Designator#4.8)
NetC5_12V_Power_And_Ground_Designator#5_2: 12V_POWER_BULKHEAD (P?#1.2), 12V Power And Ground/Designator (C5_12V_Power_And_Ground_Designator#5.2 R11_12V_Power_And_Ground_Designator#5.1 U1_12V_Power_And_Ground_Designator#5.8)
NetC5_12V_Power_And_Ground_Designator#6_2: 12V_POWER_BULKHEAD (P?#1.1), 12V Power And Ground/Designator (C5_12V_Power_And_Ground_Designator#6.2 R11_12V_Power_And_Ground_Designator#6.1 U1_12V_Power_And_Ground_Designator#6.8)
NetC5_Motor_Controller_1_Designator_2: Motor Controller 1 (P6_Motor_Controller_1.2 R6.2), Motor Controller 1/Designator (C5_Motor_Controller_1_Designator.2 R11.1 U1.8)
NetC5_Motor_Controller_2_Designator_2: Motor Controller 2 (P6_Motor_Controller_2.2 R6_Motor_Controller_2.2), Motor Controller 2/Designator (C5_Motor_Controller_2_Designator.2 R11_Motor_Controller_2_Designator.1 U1_Motor_Controller_2_Designator.8)
NetC5_Steering_Designator_2: Steering (P6_Steering.2 R6_Steering.2), Steering/Designator (C5_Steering_Designator.2 R11_Steering_Designator.1 U1_Steering_Designator.8)
NetC8_5VLS1_2: 5VBulkhead (P7.6), 5V Power And Ground/5VLS1 (C8_5VLS1.2 U_5VLS1.6)
NetC8_5VLS2_2: 5VBulkhead (P7.5), 5V Power And Ground/5VLS2 (C8_5VLS2.2 U_5VLS2.6)
NetC8_5VLS3_2: 5VBulkhead (P7.4), 5V Power And Ground/5VLS3 (C8_5VLS3.2 U_5VLS3.6)
NetC8_5VLS4_2: 5VBulkhead (P7.3), 5V Power And Ground/5VLS4 (C8_5VLS4.2 U_5VLS4.6)
NetC8_5VLS5_2: 5VBulkhead (P7.2), 5V Power And Ground/5VLS5 (C8_5VLS5.2 U_5VLS5.6)
NetC8_5VLS6_2: 5VBulkhead (P7.1), 5V Power And Ground/5VLS6 (C8_5VLS6.2 U_5VLS6.6)
NetP1_1: TOP (P1.1), STM32 (U6.23)
NetP1_2: TOP (P1.2), STM32 (U6.24)
NetP2_1: TOP (P2.1), STM32 (U6.38)
NetP2_2: TOP (P2.2), STM32 (U6.39)
NetP2_3: TOP (P2.3), STM32 (U6.65)
NetP2_4: TOP (P2.4), STM32 (U6.66)
NetP5_1: TOP (P5.1), STM32 (U6.86)
NetP5_2: TOP (P5.2), STM32 (U6.87)
NetR12_5VLS1_1: 5V Power And Ground/Shift Register (U2.15), 5V Power And Ground/5VLS1 (R12_5VLS1.1 U_5VLS1.3)
NetR12_5VLS2_1: 5V Power And Ground/Shift Register (U2.1), 5V Power And Ground/5VLS2 (R12_5VLS2.1 U_5VLS2.3)
NetR12_5VLS3_1: 5V Power And Ground/Shift Register (U2.2), 5V Power And Ground/5VLS3 (R12_5VLS3.1 U_5VLS3.3)
NetR12_5VLS4_1: 5V Power And Ground/Shift Register (U2.3), 5V Power And Ground/5VLS4 (R12_5VLS4.1 U_5VLS4.3)
NetR12_5VLS5_1: 5V Power And Ground/Shift Register (U2.4), 5V Power And Ground/5VLS5 (R12_5VLS5.1 U_5VLS5.3)
NetR12_5VLS6_1: 5V Power And Ground/Shift Register (U2.5), 5V Power And Ground/5VLS6 (R12_5VLS6.1 U_5VLS6.3)
NetR25_2: TOP (R25.2 STLINK-HEADER-1.2), STM32 (U6.72)
NetR26_2: TOP (R26.2 STLINK-HEADER-1.1), STM32 (U6.76)
NetR54_2: TOP (R54.2), STM32 (U6.93)
NetR55_2: TOP (R55.2), STM32 (U6.92)
NetU1_12V_Power_And_Ground_Designator#1_2: 12V Power And Ground/Shift Register (U2_12V_Power_And_Ground_Shift_Register.15), 12V Power And Ground/Designator (U1_12V_Power_And_Ground_Designator#1.2)
NetU1_12V_Power_And_Ground_Designator#2_2: 12V Power And Ground/Shift Register (U2_12V_Power_And_Ground_Shift_Register.1), 12V Power And Ground/Designator (U1_12V_Power_And_Ground_Designator#2.2)
NetU1_12V_Power_And_Ground_Designator#3_2: 12V Power And Ground/Shift Register (U2_12V_Power_And_Ground_Shift_Register.2), 12V Power And Ground/Designator (U1_12V_Power_And_Ground_Designator#3.2)
NetU1_12V_Power_And_Ground_Designator#4_2: 12V Power And Ground/Shift Register (U2_12V_Power_And_Ground_Shift_Register.3), 12V Power And Ground/Designator (U1_12V_Power_And_Ground_Designator#4.2)
NetU1_12V_Power_And_Ground_Designator#5_2: 12V Power And Ground/Shift Register (U2_12V_Power_And_Ground_Shift_Register.4), 12V Power And Ground/Designator (U1_12V_Power_And_Ground_Designator#5.2)
NetU1_12V_Power_And_Ground_Designator#6_2: 12V Power And Ground/Shift Register (U2_12V_Power_And_Ground_Shift_Register.5), 12V Power And Ground/Designator (U1_12V_Power_And_Ground_Designator#6.2)
STEERING_ENABLE: STM32 (U6.46), Steering/Designator (U1_Steering_Designator.2)